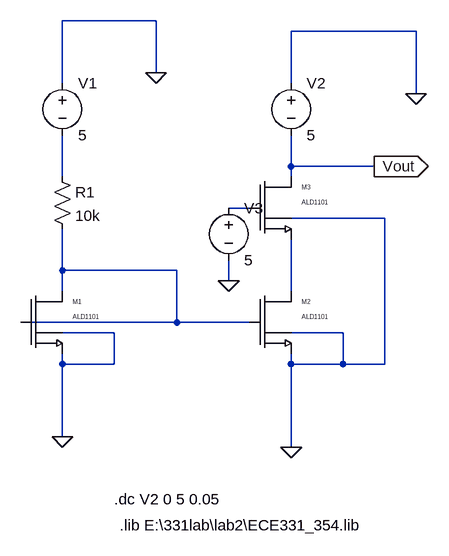
[diagram p0: schematic lab3_1.asc]
lab3_1.asc, the LTspice schematic file:
Version 4
SHEET 1 880 680
WIRE 208 -176 64 -176
WIRE 608 -160 416 -160
WIRE 208 -96 208 -176
WIRE 64 -80 64 -176
WIRE 416 -80 416 -160
WIRE 608 -64 608 -160
WIRE 416 48 416 0
WIRE 544 48 416 48
WIRE 64 64 64 0
WIRE 416 64 416 48
WIRE 352 112 320 112
WIRE 560 128 416 128
WIRE 64 208 64 144
WIRE 240 208 64 208
WIRE 320 224 320 192
WIRE 64 240 64 208
WIRE 416 240 416 160
WIRE 240 288 240 208
WIRE 240 288 0 288
WIRE 352 288 240 288
WIRE 144 304 64 304
WIRE 496 304 416 304
WIRE 64 352 64 336
WIRE 144 352 144 304
WIRE 144 352 64 352
WIRE 416 352 416 336
WIRE 496 352 496 304
WIRE 496 352 416 352
WIRE 560 352 560 128
WIRE 560 352 496 352
WIRE 64 464 64 352
WIRE 416 480 416 352
FLAG 416 480 0
FLAG 208 -96 0
FLAG 64 464 0
FLAG 608 -64 0
FLAG 320 224 0
FLAG 544 48 Vout
IOPIN 544 48 Out
SYMBOL res 48 48 R0
SYMATTR InstName R1
SYMATTR Value 10k
SYMBOL voltage 64 -96 R0
WINDOW 123 0 0 Left 2
WINDOW 39 0 0 Left 2
SYMATTR InstName V1
SYMATTR Value 5
SYMBOL ALD1101 0 240 R0
SYMATTR InstName M1
SYMBOL ALD1101 352 240 R0
SYMATTR InstName M2
SYMBOL ALD1101 352 64 R0
SYMATTR InstName M3
SYMBOL voltage 416 -96 R0
WINDOW 123 0 0 Left 2
WINDOW 39 0 0 Left 2
SYMATTR InstName V2
SYMATTR Value 5
SYMBOL voltage 320 96 R0
WINDOW 123 0 0 Left 2
WINDOW 39 0 0 Left 2
SYMATTR InstName V3
SYMATTR Value 5
TEXT 144 560 Left 2 !.dc V2 0 5 0.05
TEXT 152 600 Left 2 !.lib E:\\331lab\\lab2\\ECE331_354.lib

The netlist it stands for:
* lab3_1.asc
R1 N001 N003 10k
V1 0 N001 5
M1 N003 N003 0 0 ALD1101 W=1.379e-3 L=1E-6
M2 N004 N003 0 0 ALD1101 W=1.379e-3 L=1E-6
M3 Vout N002 N004 0 ALD1101 W=1.379e-3 L=1E-6
V2 0 Vout 5
V3 N002 0 5
.model NMOS NMOS
.model PMOS PMOS
.lib standard.mos
.dc V2 0 5 0.05
.lib E:\331lab\lab2\ECE331_354.lib
.backanno
.end